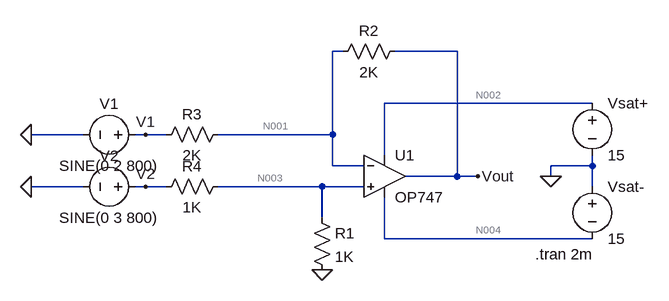
[diagram p0: schematic DIFFERNCE_AMPLIFIER.asc]
DIFFERNCE_AMPLIFIER.asc, the LTspice schematic file:
Version 4
SHEET 1 880 680
WIRE 272 -32 256 -32
WIRE 448 -32 352 -32
WIRE 656 48 336 48
WIRE -128 96 -208 96
WIRE -32 96 -48 96
WIRE 0 96 -32 96
WIRE 256 96 256 -32
WIRE 256 96 80 96
WIRE 336 128 336 48
WIRE 256 144 256 96
WIRE 304 144 256 144
WIRE 656 144 656 128
WIRE 656 144 592 144
WIRE 448 160 448 -32
WIRE 448 160 368 160
WIRE 480 160 448 160
WIRE 592 160 592 144
WIRE -128 176 -208 176
WIRE -32 176 -48 176
WIRE 0 176 -32 176
WIRE 240 176 80 176
WIRE 304 176 240 176
WIRE 656 176 656 144
WIRE 240 224 240 176
WIRE 336 256 336 192
WIRE 656 256 336 256
FLAG 592 160 0
FLAG 480 160 Vout
FLAG 240 304 0
FLAG -208 176 0
FLAG -208 96 0
FLAG -32 96 V1
FLAG -32 176 V2
SYMBOL OpAmps\\OP747 336 96 R0
SYMATTR InstName U1
SYMBOL voltage 656 32 R0
WINDOW 123 0 0 Left 0
WINDOW 39 0 0 Left 0
SYMATTR InstName Vsat+
SYMATTR Value 15
SYMBOL voltage 656 160 R0
WINDOW 123 0 0 Left 0
WINDOW 39 0 0 Left 0
SYMATTR InstName Vsat-
SYMATTR Value 15
SYMBOL res 224 208 R0
SYMATTR InstName R1
SYMATTR Value 1K
SYMBOL res 368 -48 R90
WINDOW 0 0 56 VBottom 2
WINDOW 3 32 56 VTop 2
SYMATTR InstName R2
SYMATTR Value 2K
SYMBOL res 96 80 R90
WINDOW 0 0 56 VBottom 2
WINDOW 3 32 56 VTop 2
SYMATTR InstName R3
SYMATTR Value 2K
SYMBOL res 96 160 R90
WINDOW 0 0 56 VBottom 2
WINDOW 3 32 56 VTop 2
SYMATTR InstName R4
SYMATTR Value 1K
SYMBOL voltage -32 96 R90
WINDOW 0 -32 56 VBottom 2
WINDOW 3 32 56 VTop 2
WINDOW 123 0 0 Left 0
WINDOW 39 0 0 Left 0
SYMATTR InstName V1
SYMATTR Value SINE(0 2 800)
SYMBOL voltage -32 176 R90
WINDOW 0 -32 56 VBottom 2
WINDOW 3 32 56 VTop 2
WINDOW 123 0 0 Left 0
WINDOW 39 0 0 Left 0
SYMATTR InstName V2
SYMATTR Value SINE(0 3 800)
TEXT 568 280 Left 2 !.tran 2m

The netlist it stands for:
* DIFFERNCE_AMPLIFIER.asc
XU1 N003 N001 N002 N004 Vout OP747  ; pins In+ In- V+ V- OUT
Vsat+ N002 0 15
Vsat- 0 N004 15
R1 N003 0 1K
R2 Vout N001 2K
R3 N001 V1 2K
R4 N003 V2 1K
V1 V1 0 SINE(0 2 800)
V2 V2 0 SINE(0 3 800)
.tran 2m
.backanno
.end

* Results of the author's LTspice run, read from the files saved beside the schematic
* Operating Point, zero values left out:
*   V(n001) = 85.43 µV
*   V(n004) = -15 V
*   V(n002) = 15 V
*   V(n003) = 5.428 µV
*   V(vout) = 153.1 µV
*   I(R4) = 5.428 nA
*   I(R3) = 42.71 nA
*   I(R2) = 33.86 nA
*   I(R1) = 5.428 nA
*   I(V2) = 5.428 nA
*   I(V1) = 42.71 nA
*   I(Vsat-) = -304.4 µA
*   I(Vsat+) = -304.4 µA
*   Ix(u1:1) = -10.86 nA
*   Ix(u1:2) = -8.856 nA
*   Ix(u1:99) = 304.4 µA
*   Ix(u1:50) = -304.4 µA
*   Ix(u1:45) = -33.86 nA
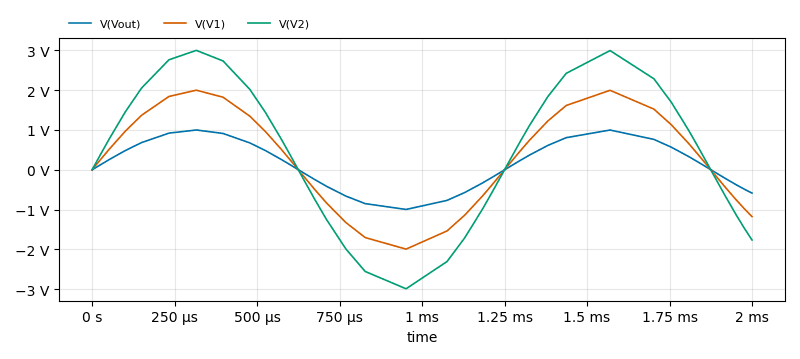
[diagram p1: Transient Analysis of DIFFERNCE_AMPLIFIER.asc, plotted from the saved traces]
* Transient Analysis, 1 run:
*   V(Vout): min -996.6 mV, max 1 V, average 177.1 mV, rms 679.4 mV, last -586 mV
*   V(V1): min -1.993 V, max 2 V, average 353.7 mV, rms 1.359 V, last -1.176 V
*   V(V2): min -2.99 V, max 3 V, average 530.6 mV, rms 2.038 V, last -1.763 V